# Altium schematic sheet PSoc.SchDoc
size A
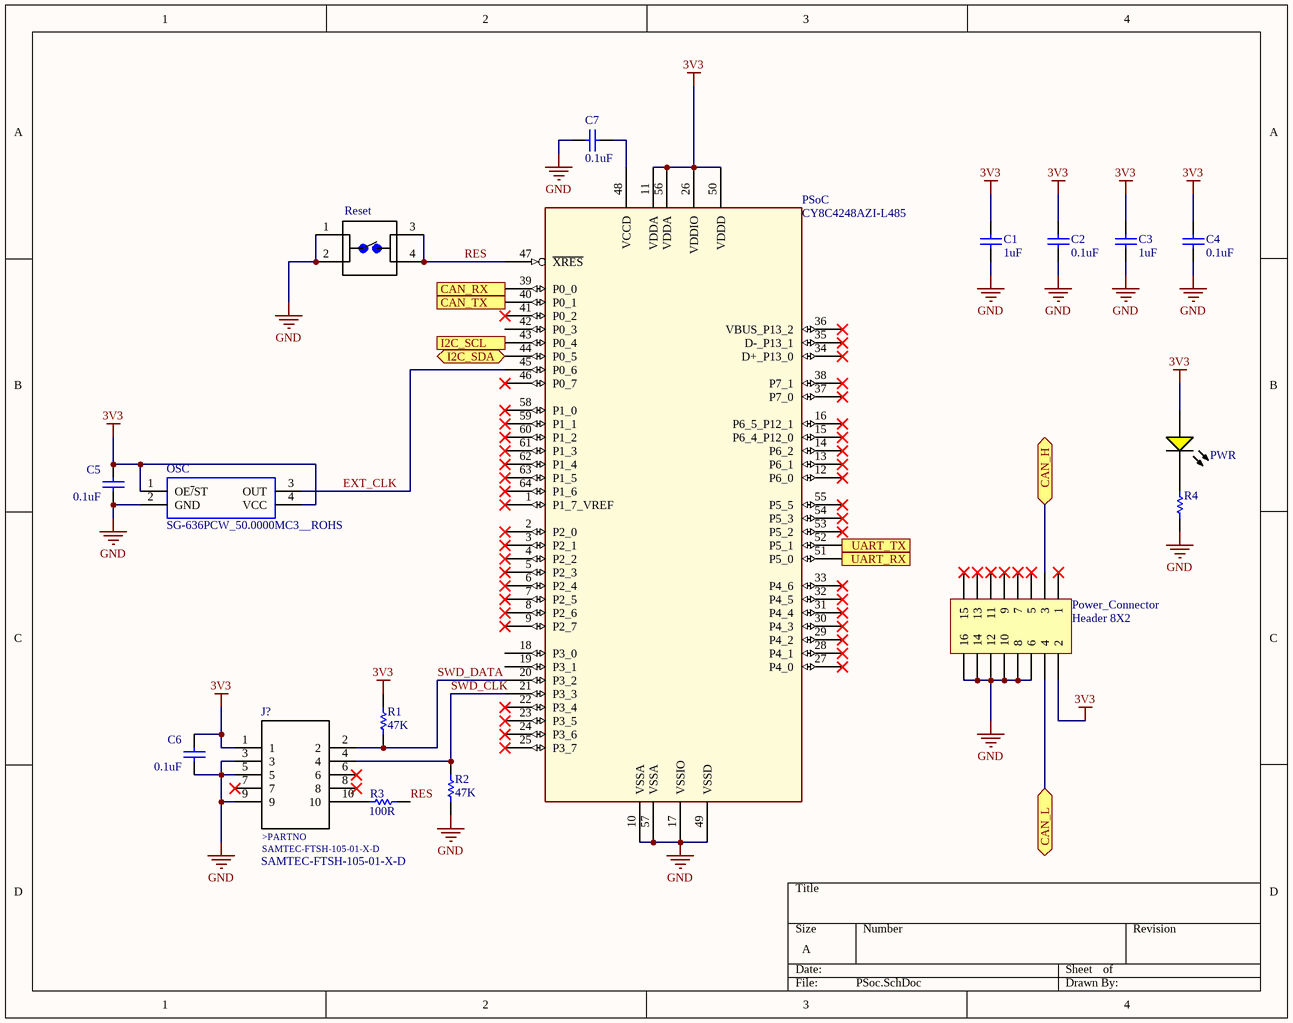
[diagram p0: PSoc.SchDoc]

## Parts
C1  1uF  [CAPC0805(2012)100_M]
C2  0.1uF  [CAPC0805(2012)100_M]
C3  1uF  [CAPC0805(2012)100_M]
C4  0.1uF  [CAPC0805(2012)100_M]
C5  0.1uF  [CAPC0805(2012)100_M]
C6  0.1uF  [CAPC0805(2012)100_M]
C7  0.1uF  [CAPC0805(2012)100_M]
J?  SAMTEC-FTSH-105-01-X-D  [SAMTEC-FTSH-105-01-X-D]
OSC  SG-636PCW_50.0000MC3__ROHS  [SG-636]
Power_Connector  Header 8X2  [HDR2X8]
PSoC  CY8C4248AZI-L485  [TQFP50P1200X1200X160-64N]
PWR  LTST-C170KSKT  [LTST-C170KSKT_V]  (value not drawn)
R1  47K  [RESC0805(2012)_N]
R2  47K  [RESC0805(2012)_N]
R3  100R  [RESC0805(2012)_N]
R4  (no value)  [RESC0805(2012)_N]
Reset  1825910-7  [Switch 6mm 24V (NO)]  (value not drawn)

## Ports
CAN_H (bidir), CAN_L (bidir), CAN_RX (in), CAN_TX (out), I2C_SCL (out), I2C_SDA (bidir), UART_RX (in), UART_TX (out)

## Nets
3V3: C1.1 C2.2 C3.1 C4.2 C5.2 C6.2 J?.1 OSC.1(OE~{/}ST) OSC.4(VCC) Power_Connector.2 PSoC.11(VDDA) PSoC.26(VDDIO) PSoC.50(VDDD) PSoC.56(VDDA) PWR.1(A) R1.2
GND: C1.2 C2.1 C3.2 C4.1 C5.1 C6.1 C7.2 J?.3 J?.5 J?.9 OSC.2(GND) Power_Connector.6 Power_Connector.8 Power_Connector.10 Power_Connector.12 Power_Connector.14 Power_Connector.16 PSoC.10(VSSA) PSoC.17(VSSIO) PSoC.49(VSSD) PSoC.57(VSSA) R2.1 R4.1 Reset.1 Reset.2
CAN_H: Power_Connector.3 ; port CAN_H
CAN_L: Power_Connector.4 ; port CAN_L
CAN_RX: PSoC.39(P0_0) ; port CAN_RX
CAN_TX: PSoC.40(P0_1) ; port CAN_TX
EXT_CLK: OSC.3(OUT) PSoC.45(P0_6)
I2C_SCL: PSoC.43(P0_4) ; port I2C_SCL
I2C_SDA: PSoC.44(P0_5) ; port I2C_SDA
RES: PSoC.47(~{XRES}) R3.2 Reset.3 Reset.4
SWD_CLK: J?.4 PSoC.21(P3_3) R2.2
SWD_DATA: J?.2 PSoC.20(P3_2) R1.1
UART_RX: PSoC.51(P5_0) ; port UART_RX
UART_TX: PSoC.52(P5_1) ; port UART_TX
NetC7_1: C7.1 PSoC.48(VCCD)
NetJ?_10: J?.10 R3.1
NetPWR_2: PWR.2(K) R4.2

Not connected (* = marked no-connect by the designer): J? 6* 7* 8*; Power_Connector 1* 5* 7* 9* 11* 13* 15*; PSoC 1(P1_7_VREF)* 2(P2_0)* 3(P2_1)* 4(P2_2)* 5(P2_3)* 6(P2_4)* 7(P2_5)* 8(P2_6)* 9(P2_7)* 12(P6_0)* 13(P6_1)* 14(P6_2)* 15(P6_4_P12_0)* 16(P6_5_P12_1)* 18(P3_0) 19(P3_1) 22(P3_4)* 23(P3_5)* 24(P3_6)* 25(P3_7)* 27(P4_0)* 28(P4_1)* 29(P4_2)* 30(P4_3)* 31(P4_4)* 32(P4_5)* 33(P4_6)* 34(D+_P13_0)* 35(D-_P13_1)* 36(VBUS_P13_2)* 37(P7_0)* 38(P7_1)* 41(P0_2)* 42(P0_3) 46(P0_7)* 53(P5_2)* 54(P5_3)* 55(P5_5)* 58(P1_0)* 59(P1_1)* 60(P1_2)* 61(P1_3)* 62(P1_4)* 63(P1_5)* 64(P1_6)*

## Notes on the sheet
- (in symbol SAMTEC-FTSH-105-01-X-D) >PARTNO

## Library data of the parts
C1-C7 = CMP-1036-01451-1: CAP 33pF 200V ±1% 0805 (2012 Metric) Thickness 1mm SMD; Tolerance: Â±1%; Case-EIA: 0805; Case-Metric: 2012; Technology: SMT; Rated Voltage: 200 V; Max Thickness: 1 mm; Value: 33pF
OSC = SG-636: Standard Clock Oscillators 50MHz 3.3Volt 100ppm -20C +70C; Manufacturer_Name: Epson Timing; Manufacturer_Part_Number: SG-636PCW 50.0000MC3: ROHS; RS Part Number: *; RS Price/Stock: *; Arrow Part Number: SG-636PCW 50.0000MC3: ROHS; Arrow Price/Stock: *; Datasheet Link: http://www.mouser.com/ds/2/137/G-636PCE_en-1003252.pdf
Power_Connector = Header 8X2: Header, 8-Pin, Dual row; LatestRevisionDate: 17-Jul-2002; LatestRevisionNote: Re-released for DXP Platform.; Publisher: Altium Limited
PWR = CMP-2000-06621-1: LED Yellow, 75 mW, 80 mA, -55 to 85 degC, 2-Pin SMD, RoHS, Tape and Reel; Manufacturer: Lite-On; Main Category: ChipLED; Product Depth (mm): 1.25mm; Dominant Wave Length: 587nm; Viewing Angle: 130deg; Luminous Intensity: 112mcd; Test Current (It): 20mA; Emitting Color: Amber; Chip Material: AlGaInP; Product Height (mm): 1.1mm; Forward Voltage: 2.4V; High Brightness: Yes; Forward Current: 30mA; Number of  Elements: 1; Power Dissipation: 75W; Shape Type: Rectangular; Peak Wavelength: 588nm; Reverse Voltage: 5V; Rad Hardened: No; Product Length (mm): 2mm; DELETED: Compliant; Package Description: 2-Pin Surface Mount Device, Body 2 x 1.25 mm; Mounting: SurfaceMount; Lum Intensity: 112mcd; Pin Count: 2; Mounting Technology: SurfaceMount; Package Reference: C170KSKT; Datasheet Version: Rev. H, 04/2014; Package Type: ChipLed; Type: Uni-Color; Packaging: TapeandReel; Manufacturer URL: http://www.us.liteon.com/; Datasheet URL: http://optoelectronics.liteon.com/upload/download/DS-22-99-0188/S_110_LTST-C170KSKT.pdf; Operating Temp Range: -55Cto85C; Lens Dimensions: 1.4x1.25x0.6mm; Operating Temperature Classification: Industrial
R1-R4 = 120R 5% 0805: 120R 0.125W 5% 0805 (2012 Metric)  SMD; Case-Metric: 2012; Value: 120.00 Ohm; Case-EIA: 0805; Tolerance: 5 %; Technology: SMT; Power: 0.125 W
Reset = Switch 6mm 24V (NO): FSM4JAH=6MM TACT SWITCH, HIGH TEMP; MF: TE Connectivity; Contact_Current_Rating: 50 mA; Configuration_Pole-Throw: Single Pole - Single Throw; Package: None; Digi-Key_Part_Number: 450-1804-ND; Digi-Key_Purchase_URL: https://www.digikey.com/product-detail/en/te-connectivity-alcoswitch-switches/1825910-7/450-1804-ND/1731414?utm_source=snapeda&utm_medium=aggregator&utm_campaign=symbol; MP: 1825910-7; SnapEDA_Link: https://www.snapeda.com/parts/1825910-7/TE%20Connectivity%20ALCOSWITCH%20Switches/view-part/?ref=snap; EU_RoHS_Compliance: Compliant; TE_purchase_URL: https://www.te.com/usa-en/product-1825910-7.html?te_bu=Cor&te_type=disp&te_campaign=seda_glo_cor-seda-global-disp-prtnr-fy19-seda-model-bom-cta_sma-317_1&elqCampaignId=32493; Value: *
PSoC = CY8C4248AZI-L485: Part_Number: CY8C4248AZI-L485